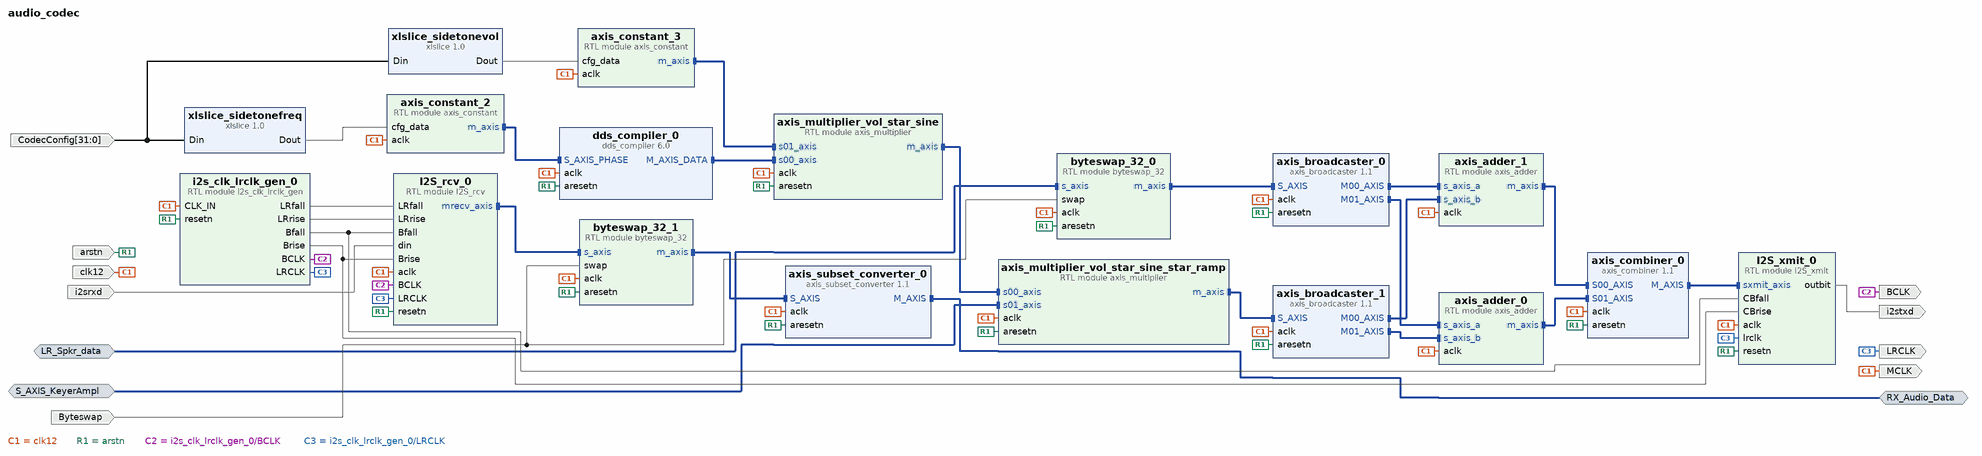
[diagram p0: block diagram of the top level]
# Vivado block design audio_codec, xc7a200tfbg676-2, Vivado 2021.2
create_bd_design audio_codec

create_bd_intf_port -mode Master -vlnv xilinx.com:interface:axis_rtl:1.0 RX_Audio_Data
set_property -dict {CONFIG.FREQ_HZ 12288000} [get_bd_intf_ports RX_Audio_Data]
create_bd_intf_port -mode Slave -vlnv xilinx.com:interface:axis_rtl:1.0 S_AXIS_KeyerAmpl
set_property -dict [list \
  CONFIG.FREQ_HZ 12288000 \
  CONFIG.HAS_TKEEP 0 \
  CONFIG.HAS_TLAST 0 \
  CONFIG.HAS_TREADY 1 \
  CONFIG.HAS_TSTRB 0 \
  CONFIG.LAYERED_METADATA undef \
  CONFIG.TDATA_NUM_BYTES 2 \
  CONFIG.TDEST_WIDTH 0 \
  CONFIG.TID_WIDTH 0 \
  CONFIG.TUSER_WIDTH 0 \
] [get_bd_intf_ports S_AXIS_KeyerAmpl]
create_bd_intf_port -mode Slave -vlnv xilinx.com:interface:axis_rtl:1.0 LR_Spkr_data
set_property -dict [list \
  CONFIG.FREQ_HZ 12288000 \
  CONFIG.HAS_TKEEP 0 \
  CONFIG.HAS_TLAST 0 \
  CONFIG.HAS_TREADY 1 \
  CONFIG.HAS_TSTRB 0 \
  CONFIG.LAYERED_METADATA undef \
  CONFIG.TDATA_NUM_BYTES 4 \
  CONFIG.TDEST_WIDTH 0 \
  CONFIG.TID_WIDTH 0 \
  CONFIG.TUSER_WIDTH 0 \
] [get_bd_intf_ports LR_Spkr_data]
create_bd_port -dir O -type clk BCLK
set_property -dict {CONFIG.FREQ_HZ 5000000} [get_bd_ports BCLK]
create_bd_port -dir I -from 31 -to 0 CodecConfig
create_bd_port -dir O -type clk LRCLK
set_property -dict {CONFIG.FREQ_HZ 1000000} [get_bd_ports LRCLK]
create_bd_port -dir O MCLK
create_bd_port -dir I -type rst arstn
create_bd_port -dir I -type clk clk12
set_property -dict [list \
  CONFIG.ASSOCIATED_BUSIF RX_Audio_Data:S_AXIS_KeyerAmpl:LR_Spkr_data \
  CONFIG.FREQ_HZ 12288000 \
] [get_bd_ports clk12]
create_bd_port -dir I i2srxd
create_bd_port -dir O i2stxd
create_bd_port -dir I Byteswap

create_bd_cell -type ip -vlnv xilinx.com:ip:axis_broadcaster:1.1 axis_broadcaster_0
set_property -dict [list \
  CONFIG.HAS_TREADY 1 \
  CONFIG.M00_TDATA_REMAP {tdata[15:0]} \
  CONFIG.M01_TDATA_REMAP {tdata[31:16]} \
  CONFIG.M_TDATA_NUM_BYTES 2 \
  CONFIG.S_TDATA_NUM_BYTES 4 \
] [get_bd_cells axis_broadcaster_0]
create_bd_cell -type ip -vlnv xilinx.com:ip:axis_broadcaster:1.1 axis_broadcaster_1
set_property -dict [list \
  CONFIG.HAS_TREADY 1 \
  CONFIG.M00_TDATA_REMAP {tdata[15:0]} \
  CONFIG.M01_TDATA_REMAP {tdata[15:0]} \
  CONFIG.M_TDATA_NUM_BYTES 2 \
  CONFIG.S_TDATA_NUM_BYTES 2 \
] [get_bd_cells axis_broadcaster_1]
create_bd_cell -type ip -vlnv xilinx.com:ip:axis_combiner:1.1 axis_combiner_0
create_bd_cell -type ip -vlnv xilinx.com:ip:dds_compiler:6.0 dds_compiler_0
set_property -dict [list \
  CONFIG.DATA_Has_TLAST Not_Required \
  CONFIG.DDS_Clock_Rate 0.048 \
  CONFIG.Frequency_Resolution 1 \
  CONFIG.Has_ARESETn true \
  CONFIG.Has_Phase_Out false \
  CONFIG.Has_TREADY true \
  CONFIG.Latency 14 \
  CONFIG.M_DATA_Has_TUSER Not_Required \
  CONFIG.Noise_Shaping Auto \
  CONFIG.Output_Frequency1 0 \
  CONFIG.Output_Selection Sine \
  CONFIG.Output_Width 16 \
  CONFIG.PINC1 0 \
  CONFIG.Phase_Increment Streaming \
  CONFIG.Phase_Width 16 \
  CONFIG.S_PHASE_Has_TUSER Not_Required \
  CONFIG.Spurious_Free_Dynamic_Range 96 \
] [get_bd_cells dds_compiler_0]
create_bd_cell -type ip -vlnv xilinx.com:ip:xlslice:1.0 xlslice_sidetonefreq
set_property -dict {CONFIG.DIN_FROM 15 CONFIG.DOUT_WIDTH 16} [get_bd_cells xlslice_sidetonefreq]
create_bd_cell -type ip -vlnv xilinx.com:ip:xlslice:1.0 xlslice_sidetonevol
set_property -dict {CONFIG.DIN_FROM 31 CONFIG.DIN_TO 16 CONFIG.DOUT_WIDTH 16} [get_bd_cells xlslice_sidetonevol]
create_bd_cell -type ip -vlnv xilinx.com:ip:axis_subset_converter:1.1 axis_subset_converter_0
set_property -dict [list \
  CONFIG.M_TDATA_NUM_BYTES 2 \
  CONFIG.S_TDATA_NUM_BYTES 4 \
  CONFIG.TDATA_REMAP {tdata[15:0]} \
] [get_bd_cells axis_subset_converter_0]
create_bd_cell -type module -reference axis_adder axis_adder_0
set_property -dict {CONFIG.AXIS_TDATA_SIGNED TRUE CONFIG.AXIS_TDATA_WIDTH 16} [get_bd_cells axis_adder_0]
create_bd_cell -type module -reference axis_adder axis_adder_1
set_property -dict {CONFIG.AXIS_TDATA_SIGNED TRUE CONFIG.AXIS_TDATA_WIDTH 16} [get_bd_cells axis_adder_1]
create_bd_cell -type module -reference axis_constant axis_constant_2
set_property -dict {CONFIG.AXIS_TDATA_WIDTH 16} [get_bd_cells axis_constant_2]
create_bd_cell -type module -reference axis_constant axis_constant_3
set_property -dict {CONFIG.AXIS_TDATA_WIDTH 16} [get_bd_cells axis_constant_3]
create_bd_cell -type module -reference i2s_clk_lrclk_gen i2s_clk_lrclk_gen_0
create_bd_cell -type module -reference I2S_xmit I2S_xmit_0
create_bd_cell -type module -reference I2S_rcv I2S_rcv_0
create_bd_cell -type module -reference byteswap_32 byteswap_32_0
create_bd_cell -type module -reference byteswap_32 byteswap_32_1
create_bd_cell -type module -reference axis_multiplier axis_multiplier_vol_star_sine
set_property -dict {CONFIG.MSize 16} [get_bd_cells axis_multiplier_vol_star_sine]
create_bd_cell -type module -reference axis_multiplier axis_multiplier_vol_star_sine_star_ramp
set_property -dict {CONFIG.MSize 16} [get_bd_cells axis_multiplier_vol_star_sine_star_ramp]

# ---- connections ----

connect_bd_intf_net [get_bd_intf_pins I2S_rcv_0/mrecv_axis] [get_bd_intf_pins byteswap_32_1/s_axis]
connect_bd_intf_net [get_bd_intf_ports LR_Spkr_data] [get_bd_intf_pins byteswap_32_0/s_axis]
connect_bd_intf_net [get_bd_intf_ports S_AXIS_KeyerAmpl] [get_bd_intf_pins axis_multiplier_vol_star_sine_star_ramp/s01_axis]
connect_bd_intf_net [get_bd_intf_pins axis_adder_0/m_axis] [get_bd_intf_pins axis_combiner_0/S01_AXIS]
connect_bd_intf_net [get_bd_intf_pins axis_adder_1/m_axis] [get_bd_intf_pins axis_combiner_0/S00_AXIS]
connect_bd_intf_net [get_bd_intf_pins axis_adder_1/s_axis_a] [get_bd_intf_pins axis_broadcaster_0/M00_AXIS]
connect_bd_intf_net [get_bd_intf_pins axis_adder_0/s_axis_a] [get_bd_intf_pins axis_broadcaster_0/M01_AXIS]
connect_bd_intf_net [get_bd_intf_pins axis_adder_1/s_axis_b] [get_bd_intf_pins axis_broadcaster_1/M00_AXIS]
connect_bd_intf_net [get_bd_intf_pins axis_adder_0/s_axis_b] [get_bd_intf_pins axis_broadcaster_1/M01_AXIS]
connect_bd_intf_net [get_bd_intf_pins axis_combiner_0/M_AXIS] [get_bd_intf_pins I2S_xmit_0/sxmit_axis]
connect_bd_intf_net [get_bd_intf_pins axis_constant_2/m_axis] [get_bd_intf_pins dds_compiler_0/S_AXIS_PHASE]
connect_bd_intf_net [get_bd_intf_pins axis_constant_3/m_axis] [get_bd_intf_pins axis_multiplier_vol_star_sine/s01_axis]
connect_bd_intf_net [get_bd_intf_pins axis_multiplier_vol_star_sine/m_axis] [get_bd_intf_pins axis_multiplier_vol_star_sine_star_ramp/s00_axis]
connect_bd_intf_net [get_bd_intf_pins axis_multiplier_vol_star_sine_star_ramp/m_axis] [get_bd_intf_pins axis_broadcaster_1/S_AXIS]
connect_bd_intf_net [get_bd_intf_ports RX_Audio_Data] [get_bd_intf_pins axis_subset_converter_0/M_AXIS]
connect_bd_intf_net [get_bd_intf_pins axis_broadcaster_0/S_AXIS] [get_bd_intf_pins byteswap_32_0/m_axis]
connect_bd_intf_net [get_bd_intf_pins byteswap_32_1/m_axis] [get_bd_intf_pins axis_subset_converter_0/S_AXIS]
connect_bd_intf_net [get_bd_intf_pins axis_multiplier_vol_star_sine/s00_axis] [get_bd_intf_pins dds_compiler_0/M_AXIS_DATA]
connect_bd_net [get_bd_ports Byteswap] [get_bd_pins byteswap_32_0/swap] [get_bd_pins byteswap_32_1/swap]
connect_bd_net [get_bd_ports CodecConfig] [get_bd_pins xlslice_sidetonefreq/Din] [get_bd_pins xlslice_sidetonevol/Din]
connect_bd_net [get_bd_pins I2S_xmit_0/outbit] [get_bd_ports i2stxd]
connect_bd_net [get_bd_ports clk12] \
  [get_bd_ports MCLK] [get_bd_pins axis_broadcaster_0/aclk] [get_bd_pins axis_broadcaster_1/aclk] \
  [get_bd_pins axis_combiner_0/aclk] [get_bd_pins dds_compiler_0/aclk] [get_bd_pins axis_subset_converter_0/aclk] \
  [get_bd_pins axis_adder_0/aclk] [get_bd_pins axis_adder_1/aclk] [get_bd_pins axis_constant_2/aclk] \
  [get_bd_pins axis_constant_3/aclk] [get_bd_pins i2s_clk_lrclk_gen_0/CLK_IN] [get_bd_pins I2S_xmit_0/aclk] \
  [get_bd_pins I2S_rcv_0/aclk] [get_bd_pins byteswap_32_1/aclk] [get_bd_pins byteswap_32_0/aclk] \
  [get_bd_pins axis_multiplier_vol_star_sine/aclk] [get_bd_pins axis_multiplier_vol_star_sine_star_ramp/aclk]
connect_bd_net [get_bd_ports arstn] \
  [get_bd_pins axis_broadcaster_0/aresetn] [get_bd_pins axis_broadcaster_1/aresetn] [get_bd_pins axis_combiner_0/aresetn] \
  [get_bd_pins axis_subset_converter_0/aresetn] [get_bd_pins i2s_clk_lrclk_gen_0/resetn] [get_bd_pins I2S_xmit_0/resetn] \
  [get_bd_pins I2S_rcv_0/resetn] [get_bd_pins byteswap_32_1/aresetn] [get_bd_pins byteswap_32_0/aresetn] \
  [get_bd_pins dds_compiler_0/aresetn] [get_bd_pins axis_multiplier_vol_star_sine/aresetn] \
  [get_bd_pins axis_multiplier_vol_star_sine_star_ramp/aresetn]
connect_bd_net [get_bd_pins i2s_clk_lrclk_gen_0/BCLK] [get_bd_ports BCLK] [get_bd_pins I2S_rcv_0/BCLK]
connect_bd_net [get_bd_pins i2s_clk_lrclk_gen_0/Bfall] [get_bd_pins I2S_xmit_0/CBfall] [get_bd_pins I2S_rcv_0/Bfall]
connect_bd_net [get_bd_pins i2s_clk_lrclk_gen_0/Brise] [get_bd_pins I2S_xmit_0/CBrise] [get_bd_pins I2S_rcv_0/Brise]
connect_bd_net [get_bd_pins i2s_clk_lrclk_gen_0/LRCLK] [get_bd_ports LRCLK] [get_bd_pins I2S_xmit_0/lrclk] [get_bd_pins I2S_rcv_0/LRCLK]
connect_bd_net [get_bd_pins i2s_clk_lrclk_gen_0/LRfall] [get_bd_pins I2S_rcv_0/LRfall]
connect_bd_net [get_bd_pins i2s_clk_lrclk_gen_0/LRrise] [get_bd_pins I2S_rcv_0/LRrise]
connect_bd_net -net is2rxd_1 [get_bd_ports i2srxd] [get_bd_pins I2S_rcv_0/din]
connect_bd_net -net xlslice_2_Dout [get_bd_pins xlslice_sidetonefreq/Dout] [get_bd_pins axis_constant_2/cfg_data]
connect_bd_net [get_bd_pins xlslice_sidetonevol/Dout] [get_bd_pins axis_constant_3/cfg_data]

validate_bd_design
save_bd_design
